# EAGLE design ct.ftdi.45.guillem.new (EAGLE 5.11)
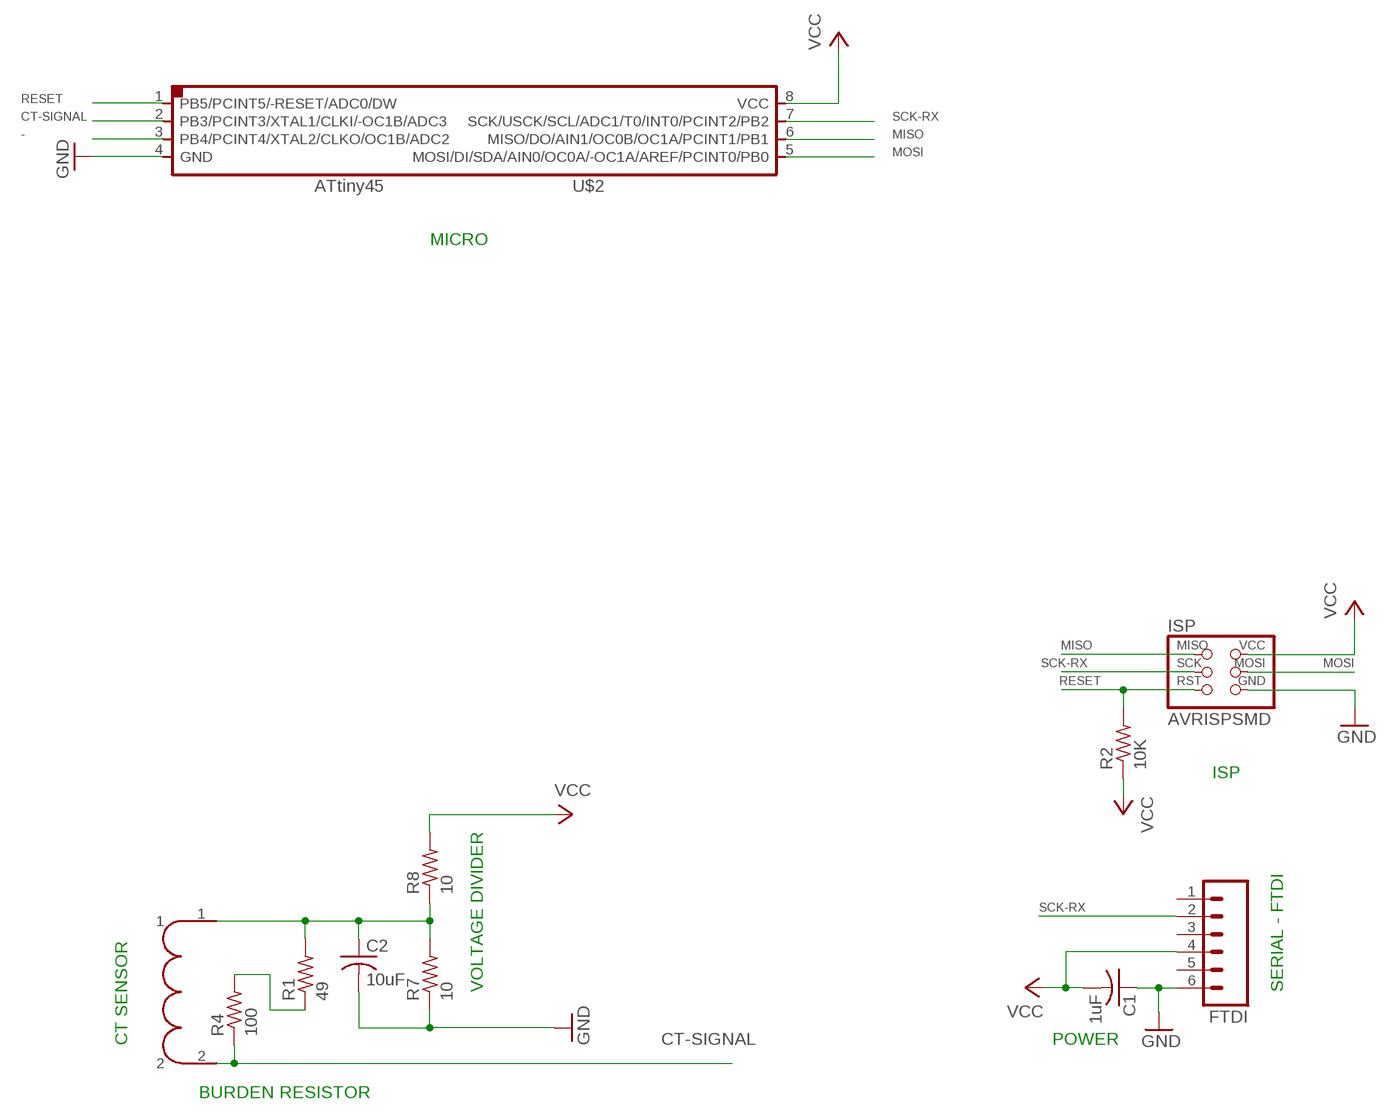
[diagram p0: schematic, sheet 1]

## Parts
C1  1uF  C-USC1206  [C1206]
C2  10uF  C-USC1206  [C1206]
FTDI  M06SMD  [1X06-SMD]
ISP  AVRISPSMD  [2X03SMD]
R1  49  R-US_R1206  [R1206]
R2  10K  R-US_R1206  [R1206]
R4  100  R-US_R1206  [R1206]
R7  10  R-US_R1206  [R1206]
R8  10  R-US_R1206  [R1206]
U$1  TA-17  [TA-17]
U$2  ATTINY45SI  [SOIC8]

## Nets
-: U$2.3(PB4/PCINT4/XTAL2/CLKO/OC1B/ADC2)
CT-SIGNAL: R4.1 U$1.2 U$2.2(PB3/PCINT3/XTAL1/CLKI/-OC1B/ADC3)
GND: C1.1 C2.2 FTDI.6 ISP.6(GND) R7.1 U$2.4(GND)
MISO: ISP.1(MISO) U$2.6(MISO/DO/AIN1/OC0B/OC1A/PCINT1/PB1)
MOSI: ISP.4(MOSI) U$2.5(MOSI/DI/SDA/AIN0/OC0A/-OC1A/AREF/PCINT0/PB0)
N$1: R1.1 R4.2
N$2: C2.1 R1.2 R7.2 R8.1 U$1.1
RESET: ISP.5(RST) R2.2 U$2.1(PB5/PCINT5/-RESET/ADC0/DW)
SCK-RX: FTDI.2 ISP.3(SCK) U$2.7(SCK/USCK/SCL/ADC1/T0/INT0/PCINT2/PB2)
VCC: C1.2 FTDI.4 ISP.2(VCC) R2.1 R8.2 U$2.8(VCC)
Unconnected: FTDI.1 FTDI.3 FTDI.5

## Notes on the sheet
- MICRO
- ISP
- VOLTAGE DIVIDER | SERIAL - FTDI
- CT SENSOR | POWER
- BURDEN RESISTOR

## Library data of the parts
C1 C2 = resistor:C-US: CAPACITOR, American symbol
FTDI = SparkFun:M06: Header 6 Standard 6-pin 0.1" header. Use with straight break away headers (SKU : PRT-00116), right angle break away headers (PRT-00553), swiss pins (PRT-00743), machine pins (PRT-00117), and female headers (PRT-00115). Molex polarized connector foot print use with SKU : PRT-08094 with associated crimp pins and housings. NOTES ON THE VARIANTS LOCK and LOCK_LONGPADS... This footprint was designed to help hold the alignment of a through-hole component (i.e. 6-pin header) while soldering it into place. You may notice that each hole has been shifted either up or down by 0.005 of an inch from it's more standard position (which is a perfectly straight line). This slight alteration caused the pins (the squares in the middle) to touch the edges of the holes. Because they are alternating, it causes a "brace" to hold the component in place. 0.005 has proven to be the perfect amount of "off-center" position when using our standard breakaway headers. Although looks a little odd when you look at the bare footprint, once you have a header in there, the alteration is very hard to notice. Also, if you push a header all the way into place, it is covered up entirely on the bottom side. This idea of altering the position of holes to aid alignment will be further integrated into the Sparkfun Library for other footprints. It can help hold any component with 3 or more connection pins.
ISP = fab:AVRISP
R1 R2 R4 R7 R8 = resistor:R-US_: RESISTOR, American symbol
U$1 = fab:TA-17: Current Transducer Non-invasive AC current transducer. More info http://iteadstudio.com/store/index.php?main_page=product_info&cPath=4&products_id=151
U$2 = fab:ATTINY45

## Net classes
0 default: width 0.356 mm

## Board
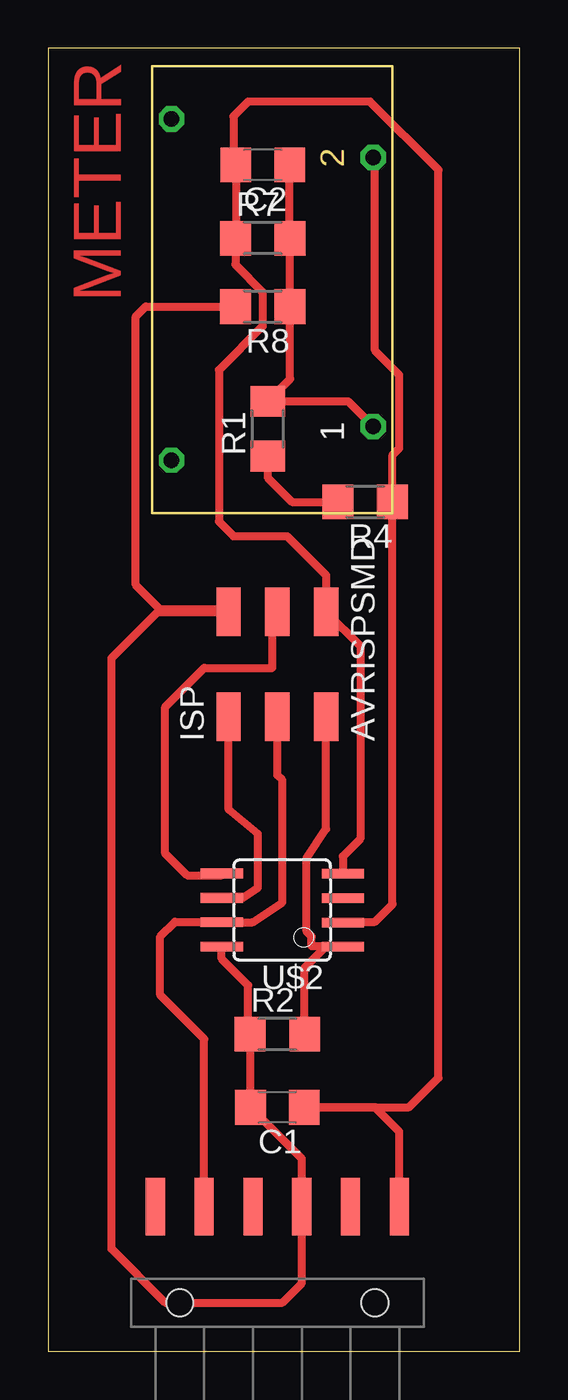
[diagram p1: board, top side]

Size 24.56 x 67.81 mm. Coordinates in mm from the lower left corner, seen from the top.
Outline: 0,0 24.56,0 24.56,67.81 0,67.81 0,0
Copper layers (1*16): Top 0.035mm / dielectric 1.5mm / Bottom 0.035mm
Design rules "default": minimum track width 10mil, minimum drill 24mil, track to track 8mil, track to pad 8mil, pad to pad 8mil, via to via 8mil, smd to smd 8mil, copper to edge 40mil, drill to drill 8mil, minimum pad ring 10mil, minimum via ring 8mil, stop-mask expansion 4mil, vias tented up to drill 0mil, thermal gap 10mil

### Footprints (pad centres in the part's own frame; a part is rotated, then mirrored left to right if it is on the bottom)
C1206 = smd 1.6 x 1.8: 1 -1.4,0; 2 1.4,0
1X06-SMD = smd 1 x 3: 1 -6.35,5; 2 -3.81,5; 3 -1.27,5; 4 1.27,5; 5 3.81,5; 6 6.35,5 | hole 1.4: -5.08,0; 5.08,0
2X03SMD = smd 2.54 x 1.27: 1 -2.54,2.54; 2 2.92,2.54; 3 -2.54,0; 4 2.92,0; 5 -2.54,-2.54; 6 2.92,-2.54
R1206 = smd 1.6 x 1.803: 1 -1.422,0; 2 1.422,0
TA-17 = drill 0.8 octagon: 1 -7,-5.75; 2 7,-5.75; 3 -8.75,4.75; 4 9,4.75
SOIC8 = smd 0.5 x 2.2: 1 -1.905,-3.154; 2 -0.645,-3.154; 3 0.625,-3.154; 4 1.895,-3.154; 5 1.905,3.154; 6 0.635,3.154; 7 -0.635,3.154; 8 -1.905,3.154

### Placement (x,y rotation side)
C1  11.94,12.7 180 top
C2  11.18,61.72 180 top
FTDI  11.94,2.54 0 top
ISP  11.94,35.56 90 top
R1  11.43,48.01 90 top
R2  11.94,16.51 0 top
R4  16.51,44.2 180 top
R7  11.18,57.91 0 top
R8  11.18,54.36 180 top
U$1  11.18,55.12 90 top
U$2  12.19,22.96 90 top

### Tracks (layer width: path | path; a pad name or v marks a point on that pad's centre or on a via)
CT-SIGNAL
  Top 0.406: U$2.2 15.38,22.35 17.02,22.35 17.93,23.27 R4.1 17.93,46.63 18.29,46.99 18.29,50.8 17.02,52.07 17.02,62.03 U$1.2
GND
  Top 0.406: 14.73,38.1 14.48,38.35 ISP.6 | U$2.4 15.35,25.76 16.26,26.67 16.26,36.7 ISP.6 | ISP.6 14.48,40.39 12.45,42.42 9.65,42.42 8.89,43.18 8.89,51.05 11.18,53.34 11.18,55.12 9.75,56.54 R7.1 9.78,57.93 C2.2 9.65,61.85 9.65,64.26 10.41,65.02 16.76,65.02 20.32,61.47 20.32,14.22 18.8,12.7 C1.1 17.02,12.7 18.29,11.43 FTDI.6
MISO
  Top 0.406: U$2.6 10.13,23.6 10.92,24.13 10.92,26.92 9.4,28.19 ISP.1
MOSI
  Top 0.406: ISP.4 11.68,38.23 11.68,35.56 8.13,35.56 6.1,33.53 6.1,25.91 7.24,24.77 9.04,24.77 U$2.5
N$1
  Top 0.406: R1.1 11.43,45.47 12.7,44.2 R4.2
N$2
  Top 0.406: C2.1 12.58,57.93 R7.2 R8.1 12.6,50.6 R1.2 15.62,49.43 U$1.1
RESET
  Top 0.406: R2.2 13.36,19.96 14.48,21.08 | 14.48,21.08 15.32,21.08 U$2.1 | 14.48,21.08 13.72,21.08 13.72,21.59 13.46,21.84 13.46,25.65 14.48,27.18 ISP.5
SCK-RX
  Top 0.406: FTDI.2 8.13,16.26 5.84,18.54 5.84,21.59 6.6,22.35 9.01,22.35 U$2.7 10.64,22.33 12.19,23.37 12.19,29.72 11.94,29.97 ISP.3
VCC
  Top 0.406: ISP.2 9.02,38.48 | U$2.8 9.04,20.43 10.41,19.05 10.41,16.61 R2.1 10.54,16.49 C1.2 13.21,10.03 13.21,8.64 FTDI.4 13.21,3.56 12.19,2.54 6.1,2.54 3.3,5.33 3.3,36.07 5.71,38.48 ISP.2 | R8.2 5.08,54.36 4.57,53.85 4.57,39.88 5.84,38.61 9.27,38.61 ISP.2

### Text on the board
Top: METER